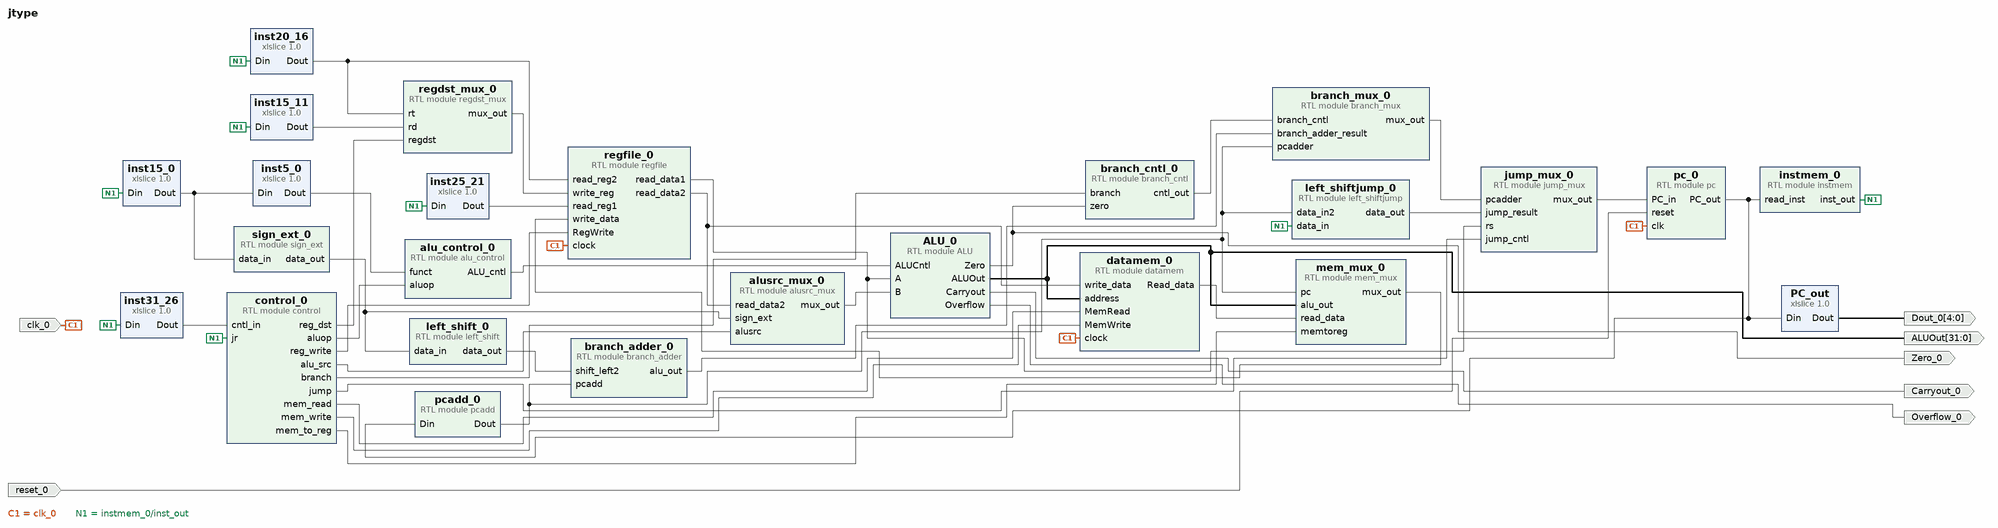
[diagram p0: block diagram of the top level]
# Vivado block design jtype, xc7a35tcpg236-1, Vivado 2021.2
create_bd_design jtype

create_bd_port -dir O -from 31 -to 0 ALUOut
create_bd_port -dir O Carryout_0
create_bd_port -dir O -from 4 -to 0 Dout_0
create_bd_port -dir O Overflow_0
create_bd_port -dir O Zero_0
create_bd_port -dir I -type clk clk_0
create_bd_port -dir I -type rst reset_0

create_bd_cell -type ip -vlnv xilinx.com:ip:xlslice:1.0 PC_out
set_property -dict {CONFIG.DIN_FROM 6 CONFIG.DIN_TO 2 CONFIG.DOUT_WIDTH 5} [get_bd_cells PC_out]
create_bd_cell -type module -reference alu_control alu_control_0
create_bd_cell -type module -reference alusrc_mux alusrc_mux_0
create_bd_cell -type module -reference branch_adder branch_adder_0
create_bd_cell -type module -reference branch_cntl branch_cntl_0
create_bd_cell -type module -reference branch_mux branch_mux_0
create_bd_cell -type module -reference datamem datamem_0
create_bd_cell -type ip -vlnv xilinx.com:ip:xlslice:1.0 inst15_0
set_property -dict {CONFIG.DIN_FROM 15 CONFIG.DOUT_WIDTH 16} [get_bd_cells inst15_0]
create_bd_cell -type ip -vlnv xilinx.com:ip:xlslice:1.0 inst15_11
set_property -dict {CONFIG.DIN_FROM 15 CONFIG.DIN_TO 11 CONFIG.DOUT_WIDTH 5} [get_bd_cells inst15_11]
create_bd_cell -type ip -vlnv xilinx.com:ip:xlslice:1.0 inst20_16
set_property -dict {CONFIG.DIN_FROM 20 CONFIG.DIN_TO 16 CONFIG.DOUT_WIDTH 5} [get_bd_cells inst20_16]
create_bd_cell -type ip -vlnv xilinx.com:ip:xlslice:1.0 inst25_21
set_property -dict {CONFIG.DIN_FROM 25 CONFIG.DIN_TO 21 CONFIG.DOUT_WIDTH 5} [get_bd_cells inst25_21]
create_bd_cell -type ip -vlnv xilinx.com:ip:xlslice:1.0 inst31_26
set_property -dict {CONFIG.DIN_FROM 31 CONFIG.DIN_TO 26 CONFIG.DOUT_WIDTH 6} [get_bd_cells inst31_26]
create_bd_cell -type ip -vlnv xilinx.com:ip:xlslice:1.0 inst5_0
set_property -dict {CONFIG.DIN_FROM 5 CONFIG.DIN_WIDTH 16 CONFIG.DOUT_WIDTH 6} [get_bd_cells inst5_0]
create_bd_cell -type module -reference jump_mux jump_mux_0
create_bd_cell -type module -reference left_shift left_shift_0
create_bd_cell -type module -reference mem_mux mem_mux_0
create_bd_cell -type module -reference pc pc_0
create_bd_cell -type module -reference pcadd pcadd_0
create_bd_cell -type module -reference regdst_mux regdst_mux_0
create_bd_cell -type module -reference regfile regfile_0
create_bd_cell -type module -reference sign_ext sign_ext_0
create_bd_cell -type module -reference control control_0
create_bd_cell -type module -reference left_shiftjump left_shiftjump_0
create_bd_cell -type module -reference ALU ALU_0
create_bd_cell -type module -reference instmem instmem_0

# ---- connections ----

connect_bd_net [get_bd_pins ALU_0/ALUOut] [get_bd_ports ALUOut] [get_bd_pins mem_mux_0/alu_out] [get_bd_pins datamem_0/address]
connect_bd_net [get_bd_pins ALU_0/Carryout] [get_bd_ports Carryout_0]
connect_bd_net [get_bd_pins ALU_0/Overflow] [get_bd_ports Overflow_0]
connect_bd_net [get_bd_pins ALU_0/Zero] [get_bd_ports Zero_0] [get_bd_pins branch_cntl_0/zero]
connect_bd_net [get_bd_pins PC_out/Dout] [get_bd_ports Dout_0]
connect_bd_net [get_bd_pins alu_control_0/ALU_cntl] [get_bd_pins ALU_0/ALUCntl]
connect_bd_net [get_bd_pins alusrc_mux_0/mux_out] [get_bd_pins ALU_0/B]
connect_bd_net [get_bd_pins branch_adder_0/alu_out] [get_bd_pins branch_mux_0/branch_adder_result]
connect_bd_net [get_bd_pins branch_cntl_0/cntl_out] [get_bd_pins branch_mux_0/branch_cntl]
connect_bd_net [get_bd_pins branch_mux_0/mux_out] [get_bd_pins jump_mux_0/pcadder]
connect_bd_net -net clk_0_1 [get_bd_ports clk_0] [get_bd_pins pc_0/clk] [get_bd_pins regfile_0/clock] [get_bd_pins datamem_0/clock]
connect_bd_net [get_bd_pins control_0/alu_src] [get_bd_pins alusrc_mux_0/alusrc]
connect_bd_net [get_bd_pins control_0/aluop] [get_bd_pins alu_control_0/aluop]
connect_bd_net [get_bd_pins control_0/branch] [get_bd_pins branch_cntl_0/branch]
connect_bd_net [get_bd_pins control_0/jump] [get_bd_pins jump_mux_0/jump_cntl]
connect_bd_net [get_bd_pins control_0/mem_read] [get_bd_pins datamem_0/MemRead]
connect_bd_net [get_bd_pins control_0/mem_to_reg] [get_bd_pins mem_mux_0/memtoreg]
connect_bd_net [get_bd_pins control_0/mem_write] [get_bd_pins datamem_0/MemWrite]
connect_bd_net [get_bd_pins control_0/reg_dst] [get_bd_pins regdst_mux_0/regdst]
connect_bd_net [get_bd_pins control_0/reg_write] [get_bd_pins regfile_0/RegWrite]
connect_bd_net [get_bd_pins datamem_0/Read_data] [get_bd_pins mem_mux_0/read_data]
connect_bd_net [get_bd_pins inst15_11/Dout] [get_bd_pins regdst_mux_0/rd]
connect_bd_net [get_bd_pins inst20_16/Dout] [get_bd_pins regfile_0/read_reg2] [get_bd_pins regdst_mux_0/rt]
connect_bd_net [get_bd_pins inst25_21/Dout] [get_bd_pins regfile_0/read_reg1]
connect_bd_net [get_bd_pins inst5_0/Dout] [get_bd_pins alu_control_0/funct]
connect_bd_net [get_bd_pins instmem_0/inst_out] \
  [get_bd_pins inst31_26/Din] [get_bd_pins inst25_21/Din] [get_bd_pins inst20_16/Din] [get_bd_pins inst15_11/Din] \
  [get_bd_pins inst15_0/Din] [get_bd_pins control_0/jr] [get_bd_pins left_shiftjump_0/data_in]
connect_bd_net [get_bd_pins jump_mux_0/mux_out] [get_bd_pins pc_0/PC_in]
connect_bd_net [get_bd_pins left_shift_0/data_out] [get_bd_pins branch_adder_0/shift_left2]
connect_bd_net [get_bd_pins left_shiftjump_0/data_out] [get_bd_pins jump_mux_0/jump_result]
connect_bd_net [get_bd_pins mem_mux_0/mux_out] [get_bd_pins regfile_0/write_data]
connect_bd_net [get_bd_pins pc_0/PC_out] [get_bd_pins pcadd_0/Din] [get_bd_pins PC_out/Din] [get_bd_pins instmem_0/read_inst]
connect_bd_net [get_bd_pins pcadd_0/Dout] \
  [get_bd_pins branch_adder_0/pcadd] [get_bd_pins branch_mux_0/pcadder] [get_bd_pins mem_mux_0/pc] \
  [get_bd_pins left_shiftjump_0/data_in2]
connect_bd_net [get_bd_pins regdst_mux_0/mux_out] [get_bd_pins regfile_0/write_reg]
connect_bd_net [get_bd_pins regfile_0/read_data1] [get_bd_pins jump_mux_0/rs] [get_bd_pins ALU_0/A]
connect_bd_net [get_bd_pins regfile_0/read_data2] [get_bd_pins alusrc_mux_0/read_data2] [get_bd_pins datamem_0/write_data]
connect_bd_net -net reset_0_1 [get_bd_ports reset_0] [get_bd_pins pc_0/reset]
connect_bd_net [get_bd_pins sign_ext_0/data_out] [get_bd_pins left_shift_0/data_in] [get_bd_pins alusrc_mux_0/sign_ext]
connect_bd_net -net xlslice_0_Dout [get_bd_pins inst31_26/Dout] [get_bd_pins control_0/cntl_in]
connect_bd_net -net xlslice_4_Dout [get_bd_pins inst15_0/Dout] [get_bd_pins inst5_0/Din] [get_bd_pins sign_ext_0/data_in]

validate_bd_design
save_bd_design
